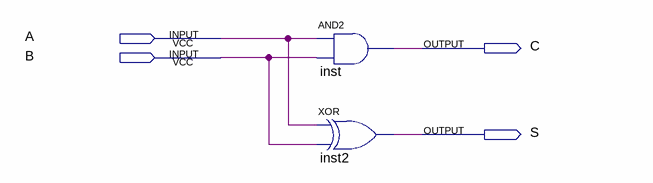
[diagram p0: schematic sheet]
// Quartus schematic half_adder.bdf as structural Verilog: 2 symbols, 4 pins
module half_adder (
  input  A,
  input  B,
  output C,
  output S
);

  and inst (C, A, B);
  xor inst2 (S, A, B);
endmodule
